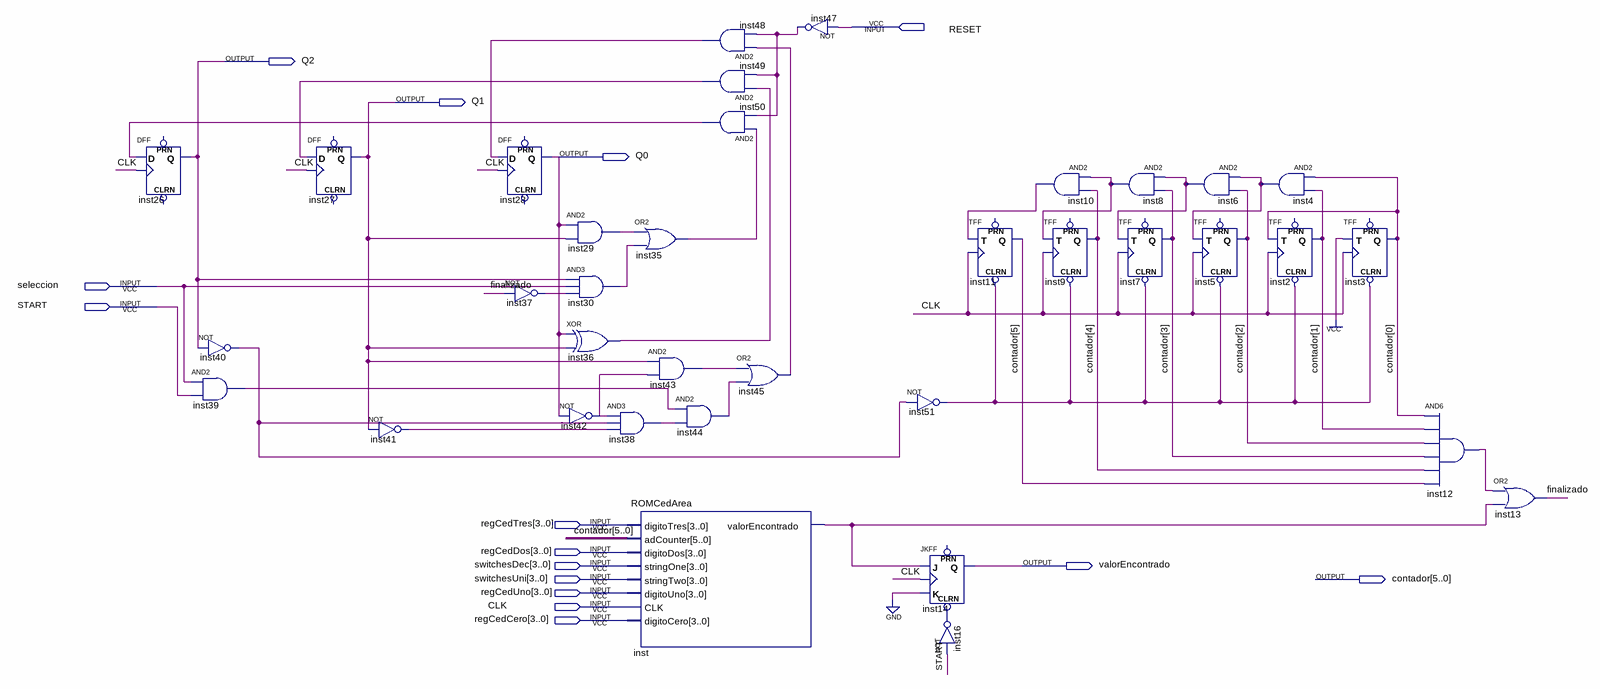
[diagram p0: schematic sheet]
// Quartus schematic procesoCinco.bdf as structural Verilog: 36 symbols, 15 pins
module procesoCinco (
  input  RESET,
  input  seleccion,
  input  START,
  input  [3:0] regCedTres,
  input  [3:0] regCedDos,
  input  [3:0] switchesDec,
  input  [3:0] switchesUni,
  input  [3:0] regCedUno,
  input  CLK,
  input  [3:0] regCedCero,
  output Q2,
  output Q1,
  output Q0,
  output valorEncontrado,
  output [5:0] contador
);

  wire finalizado, inst4_out, inst6_out, inst8_out, inst10_out, inst12_out, inst16_out, inst29_out,
       inst30_out, inst35_out, inst36_out, inst37_out, inst38_out, inst39_out, inst40_out, inst41_out,
       inst42_out, inst43_out, inst44_out, inst45_out, inst47_out, inst48_out, inst49_out, inst50_out,
       inst51_out, inst_valorencontrado;

  DFF inst26 (.CLK(CLK), .D(inst50_out), .Q(Q2));  // open: CLRN, PRN
  not inst40 (inst40_out, Q2);
  and inst39 (inst39_out, seleccion, START);
  DFF inst27 (.CLK(CLK), .D(inst49_out), .Q(Q1));  // open: CLRN, PRN
  not inst41 (inst41_out, Q1);
  DFF inst28 (.CLK(CLK), .D(inst48_out), .Q(Q0));  // open: CLRN, PRN
  not inst37 (inst37_out, finalizado);
  not inst42 (inst42_out, Q0);
  and inst29 (inst29_out, Q0, Q1);
  and inst30 (inst30_out, Q2, seleccion, inst37_out);
  xor inst36 (inst36_out, Q0, Q1);
  and inst38 (inst38_out, inst42_out, inst40_out, inst41_out);
  or inst35 (inst35_out, inst29_out, inst30_out);
  and inst43 (inst43_out, Q1, inst42_out);
  ROMCedArea inst (
    .digitoTres(regCedTres), .adCounter(contador), .digitoDos(regCedDos), .stringOne(switchesDec),
    .stringTwo(switchesUni), .digitoUno(regCedUno), .CLK(CLK), .digitoCero(regCedCero),
    .valorEncontrado(inst_valorencontrado));
  and inst48 (inst48_out, inst45_out, inst47_out);
  and inst49 (inst49_out, inst36_out, inst47_out);
  and inst50 (inst50_out, inst35_out, inst47_out);
  and inst44 (inst44_out, inst39_out, inst38_out);
  or inst45 (inst45_out, inst43_out, inst44_out);
  not inst47 (inst47_out, RESET);
  not inst51 (inst51_out, inst40_out);
  JKFF inst14 (.CLRN(inst16_out), .K(1'b0), .J(inst_valorencontrado), .CLK(CLK), .Q(valorEncontrado));  // open: PRN
  not inst16 (inst16_out, START);
  TFF inst11 (.CLRN(inst51_out), .T(inst10_out), .CLK(CLK), .Q(contador[5]));  // open: PRN
  and inst10 (inst10_out, inst8_out, contador[4]);
  TFF inst9 (.CLRN(inst51_out), .T(inst8_out), .CLK(CLK), .Q(contador[4]));  // open: PRN
  and inst8 (inst8_out, inst6_out, contador[3]);
  TFF inst7 (.CLRN(inst51_out), .T(inst6_out), .CLK(CLK), .Q(contador[3]));  // open: PRN
  and inst6 (inst6_out, inst4_out, contador[2]);
  TFF inst5 (.CLRN(inst51_out), .T(inst4_out), .CLK(CLK), .Q(contador[2]));  // open: PRN
  and inst4 (inst4_out, contador[0], contador[1]);
  TFF inst2 (.CLRN(inst51_out), .T(contador[0]), .CLK(CLK), .Q(contador[1]));  // open: PRN
  TFF inst3 (.CLRN(inst51_out), .T(1'b1), .CLK(CLK), .Q(contador[0]));  // open: PRN
  and inst12 (inst12_out, contador[0], contador[1], contador[2], contador[3], contador[4], contador[5]);
  or inst13 (finalizado, inst12_out, inst_valorencontrado);
endmodule
